# EAGLE design tft-touch (EAGLE 9.6.2)
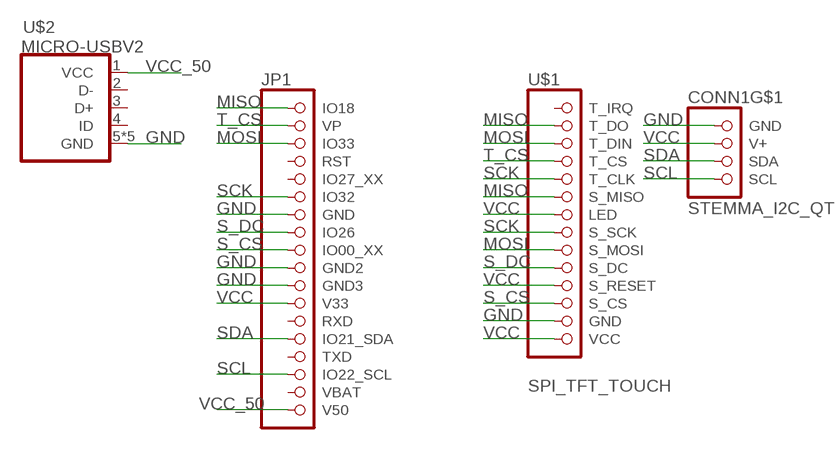
[diagram p0: schematic, sheet 1]

## Parts
CONN1  STEMMA_I2C_QT  [JST_SH4]
JP1  TTGO-TS-ESP32  [00_2X9]
U$1  SPI_TFT_TOUCH  [1X14_ROUND_70]
U$2  MICRO-USBV2  [MICRO-USB-2]

## Nets
GND: CONN1.1(GND) JP1.7(GND) JP1.10(GND2) JP1.11(GND3) U$1.13(GND) U$2.5(GND) U$2.P$1(GND) U$2.P$2(GND) U$2.P$3(GND) U$2.P$4(GND)
MISO: JP1.1(IO18) U$1.2(T_DO) U$1.6(S_MISO)
MOSI: JP1.3(IO33) U$1.3(T_DIN) U$1.9(S_MOSI)
S_CS: JP1.9(IO00_XX) U$1.12(S_CS)
S_DC: JP1.8(IO26) U$1.10(S_DC)
SCK: JP1.6(IO32) U$1.5(T_CLK) U$1.8(S_SCK)
SCL: CONN1.4(SCL) JP1.16(IO22_SCL)
SDA: CONN1.3(SDA) JP1.14(IO21_SDA)
T_CS: JP1.2(VP) U$1.4(T_CS)
VCC: CONN1.2(V+) JP1.12(V33) U$1.7(LED) U$1.11(S_RESET) U$1.14(VCC)
VCC_50: JP1.18(V50) U$2.1(VCC)
Unconnected: CONN1.MT1(MT) CONN1.MT2(MT) JP1.4(RST) JP1.5(IO27_XX) JP1.13(RXD) JP1.15(TXD) JP1.17(VBAT) U$1.1(T_IRQ) U$2.2(D-) U$2.3(D+) U$2.4(ID)

## Library data of the parts
CONN1 = 00jim:STEMMA_I2C
JP1 = 00jim:TTGO-TS-ESP32: PIN HEADER
U$1 = 00jim:SPI_TFT_TOUCH
U$2 = microusb:MICRO-USB: Micro USB B connector

## Board
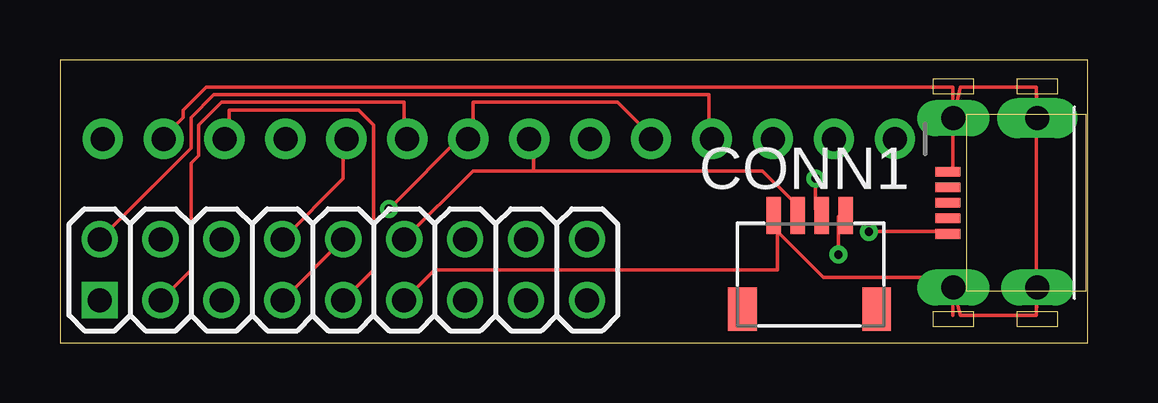
[diagram p1: board, top side]
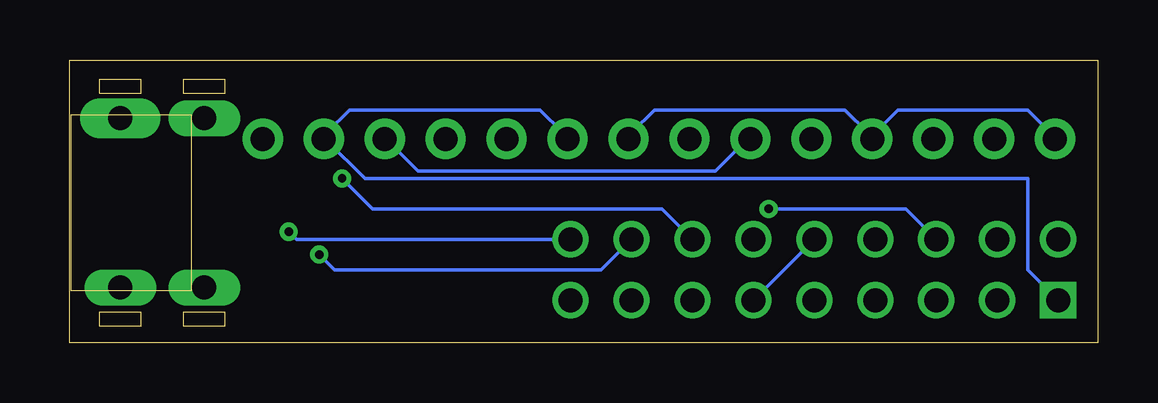
[diagram p2: board, bottom side, seen from below]

Size 42.85 x 11.8 mm. Coordinates in mm from the lower left corner, seen from the top.
Outline: 0,0 42.85,0 42.85,11.8 0,11.8 0,0
Copper layers (1*16): Top 0.035mm / dielectric 1.5mm / Bottom 0.035mm
Design rules "default": minimum track width 6mil, minimum drill 0.35mm, track to track 6mil, track to pad 6mil, pad to pad 6mil, via to via 6mil, smd to smd 6mil, copper to edge 40mil, drill to drill 6mil, minimum pad ring 10mil, minimum via ring 8mil, stop-mask expansion 4mil, vias tented up to drill 0mil, thermal gap 10mil

### Footprints (pad centres in the part's own frame; a part is rotated, then mirrored left to right if it is on the bottom)
JST_SH4 = smd 0.6 x 1.55: 1 -1.5,2.514; 2 -0.5,2.514; 3 0.5,2.514; 4 1.5,2.514 | smd 1.2 x 1.8: MT1 -2.8,-1.386; MT2 2.8,-1.386
00_2X9 = drill 1 square: 1 0,0 | drill 1: 2 0,2.54; 3 2.54,0; 4 2.54,2.54; 5 5.08,0; 6 5.08,2.54; 7 7.62,0; 8 7.62,2.54; 9 10.16,0; 10 10.16,2.54; 11 12.7,0; 12 12.7,2.54; 13 15.24,0; 14 15.24,2.54; 15 17.78,0; 16 17.78,2.54; 17 20.32,0; 18 20.32,2.54
1X14_ROUND_70 = drill 1 pad 1.676: 1 -17.78,0; 2 -15.24,0; 3 -12.7,0; 4 -10.16,0; 5 -7.62,0; 6 -5.08,0; 7 -2.54,0; 8 0,0; 9 2.54,0; 10 5.08,0; 11 7.62,0; 12 10.16,0; 13 12.7,0; 14 15.24,0
MICRO-USB-2 = smd 0.4 x 1.05: 1 -1.3,5.275; 2 -0.65,5.275; 3 0,5.275; 4 0.65,5.275; 5 1.3,5.275 | drill 1 pad 1.4 long: P$1 -3.531,5.05; P$2 -3.531,1.55; P$3 3.531,5.05 | drill 1 pad 1.676 long: P$4 3.531,1.55

### Placement (x,y rotation side)
CONN1  31.24,2.79 0 top
JP1  1.65,1.78 0 top
U$1  17.02,8.51 180 top
U$2  42.29,5.84 90 top

### Tracks (layer width: path | path; a pad name or v marks a point on that pad's centre or on a via)
GND
  Top 0.152: JP1.10 JP1.7 | 29.91,4.63 29.91,5.27 CONN1.1 29.91,4.63 | 29.91,4.63 31.81,2.73 37.21,2.73 37.21,1.14 U$2.P$1 37.53,1.14 40.7,1.14 | JP1.11 15.62,3.05 29.91,3.05 29.91,4.63 | 37.21,10.67 37.21,7.18 U$2.5 | 37.21,10.67 6.1,10.67 5.14,9.71 5.14,9.4 4.51,8.76 U$1.13 | 37.21,10.67 U$2.P$3 37.53,10.67 40.7,10.67 | 40.7,10.67 40.7,1.14 | 40.7,1.14 U$2.P$2 | 40.7,10.67 U$2.P$4
  Bottom 0.152: JP1.10 JP1.11
MISO
  Bottom 0.152: JP1.1 2.92,3.05 2.92,6.86 30.54,6.86 32.13,8.45 U$1.2 32.13,8.76 31.18,9.71 23.24,9.71 22.29,8.76 U$1.6
MOSI
  Top 0.152: JP1.3 5.46,3.05 5.46,7.49 5.78,7.81 5.78,9.08 6.73,10.03 14.35,10.03 14.35,8.76 U$1.9
  Bottom 0.152: U$1.3 29.59,8.45 28.32,7.18 15.94,7.18 14.67,8.45 U$1.9
S_CS
  Top 0.152: JP1.9 13.08,3.05 13.08,9.08 12.45,9.71 7.05,9.71 7.05,8.76 U$1.12
S_DC
  Top 0.152: JP1.8 11.81,6.86 11.81,8.45 U$1.10
SCK  (via drill 0.35)
  Top 0.152: v13.72,5.59 16.89,8.76 U$1.8 17.21,8.76 17.21,10.03 23.24,10.03 24.51,8.76 U$1.5
  Bottom 0.152: JP1.6 8,5.59 v13.72,5.59
SCL  (via drill 0.35)
  Top 0.152: v32.45,3.68 32.45,5.27 CONN1.4
  Bottom 0.152: v32.45,3.68 31.81,3.05 20.7,3.05 JP1.16
SDA  (via drill 0.35)
  Top 0.152: v31.5,6.86 31.5,5.59 CONN1.3
  Bottom 0.152: v31.5,6.86 30.23,5.59 18.16,5.59 JP1.14
T_CS
  Top 0.152: JP1.2 5.46,8.13 5.46,9.4 6.41,10.35 27.05,10.35 27.05,8.76 U$1.4
VCC
  Top 0.152: 19.75,7.18 29.27,7.18 30.54,5.91 30.54,5.59 CONN1.2 | 19.75,7.18 19.75,8.45 U$1.7 | JP1.12 17.21,7.18 19.75,7.18
  Bottom 0.152: U$1.14 1.97,8.76 2.92,9.71 8.32,9.71 9.27,8.76 U$1.11 9.59,8.76 10.54,9.71 18.48,9.71 19.43,8.76 U$1.7
VCC_50  (via drill 0.35)
  Top 0.152: v33.72,4.63 36.89,4.63 U$2.1
  Bottom 0.152: v33.72,4.63 33.4,4.32 JP1.18